# Altium schematic sheet iPhone11-2NEI.SchDoc
size A
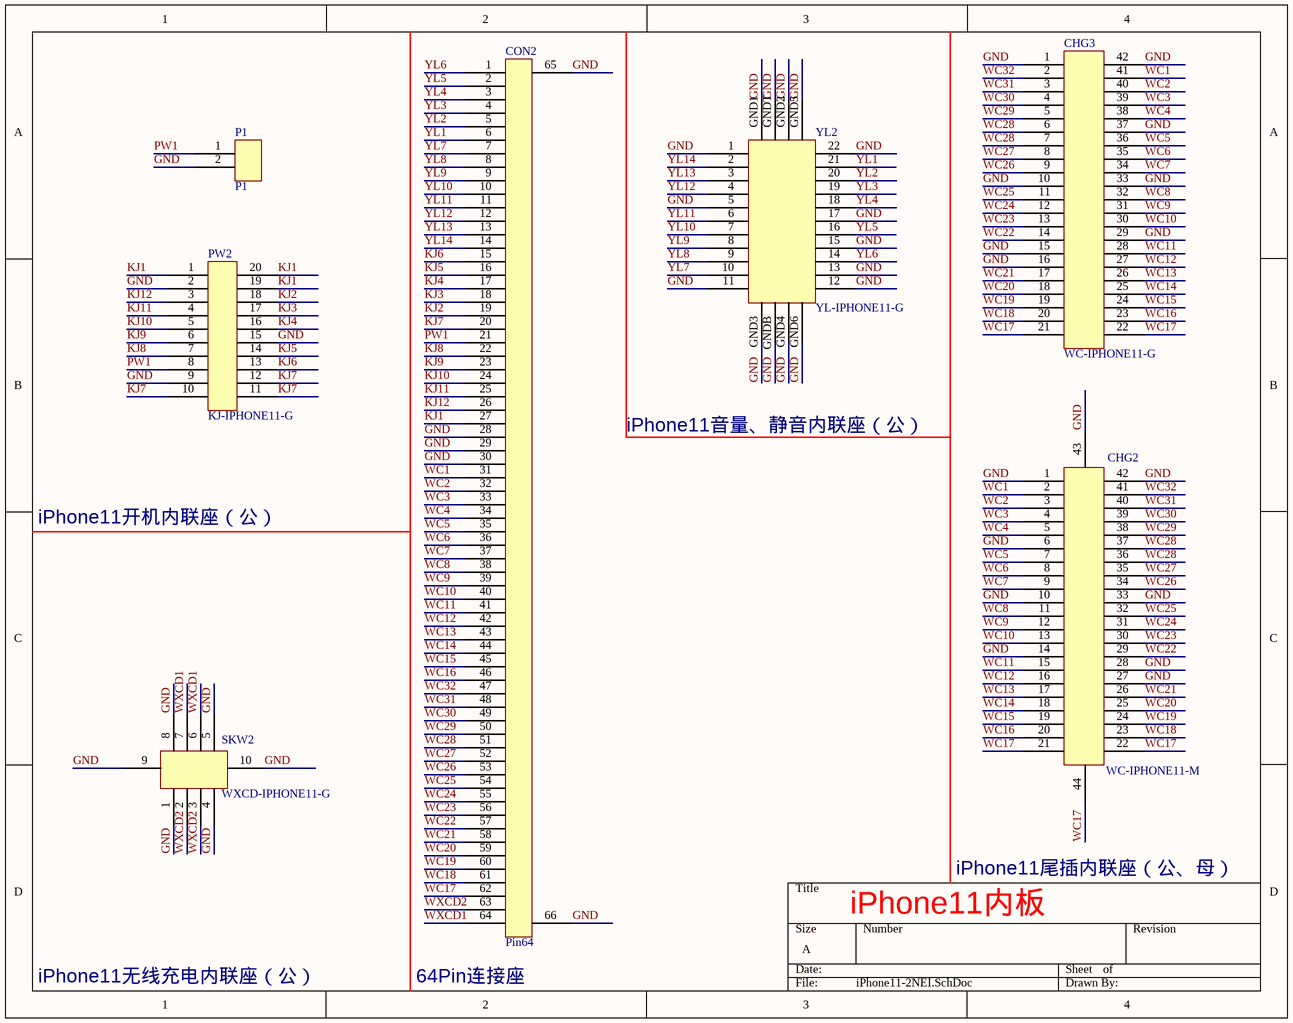
[diagram p0: iPhone11-2NEI.SchDoc]

## Parts
CHG2  WC-IPHONE11-M  [IPHONE11-WC-M]
CHG3  WC-IPHONE11-G  [IPHONE11-WC-G]
CON2  Pin64  [Pin64]
P1  P1  [P-2]
PW2  KJ-IPHONE11-G  [IPHONE11-KJ-G]
SKW2  WXCD-IPHONE11-G  [IPHONE11-WXCD-G]
YL2  YL-IPHONE11-G  [IPHONE11-YL-G]

## Nets
GND: CHG2.1 CHG2.6 CHG2.10 CHG2.14 CHG2.27 CHG2.28 CHG2.33 CHG2.42 CHG2.43 CHG3.1 CHG3.10 CHG3.15 CHG3.16 CHG3.29 CHG3.33 CHG3.37 CHG3.42 CON2.28 CON2.29 CON2.30 CON2.65 CON2.66 P1.2 PW2.2 PW2.9 PW2.15 SKW2.1 SKW2.4 SKW2.5 SKW2.8 SKW2.9 SKW2.10 YL2.1 YL2.5 YL2.11 YL2.12 YL2.13 YL2.15 YL2.17 YL2.22 YL2.GND1 YL2.GND2 YL2.GND3 YL2.GND4 YL2.GND5 YL2.GND6 YL2.GNDB YL2.GNDT
KJ1: CON2.27 PW2.1 PW2.19 PW2.20
KJ2: CON2.19 PW2.18
KJ3: CON2.18 PW2.17
KJ4: CON2.17 PW2.16
KJ5: CON2.16 PW2.14
KJ6: CON2.15 PW2.13
KJ7: CON2.20 PW2.10 PW2.11 PW2.12
KJ8: CON2.22 PW2.7
KJ9: CON2.23 PW2.6
KJ10: CON2.24 PW2.5
KJ11: CON2.25 PW2.4
KJ12: CON2.26 PW2.3
PW1: CON2.21 P1.1 PW2.8
WC1: CHG2.2 CHG3.41 CON2.31
WC2: CHG2.3 CHG3.40 CON2.32
WC3: CHG2.4 CHG3.39 CON2.33
WC4: CHG2.5 CHG3.38 CON2.34
WC5: CHG2.7 CHG3.36 CON2.35
WC6: CHG2.8 CHG3.35 CON2.36
WC7: CHG2.9 CHG3.34 CON2.37
WC8: CHG2.11 CHG3.32 CON2.38
WC9: CHG2.12 CHG3.31 CON2.39
WC10: CHG2.13 CHG3.30 CON2.40
WC11: CHG2.15 CHG3.28 CON2.41
WC12: CHG2.16 CHG3.27 CON2.42
WC13: CHG2.17 CHG3.26 CON2.43
WC14: CHG2.18 CHG3.25 CON2.44
WC15: CHG2.19 CHG3.24 CON2.45
WC16: CHG2.20 CHG3.23 CON2.46
WC17: CHG2.21 CHG2.22 CHG2.44 CHG3.21 CHG3.22 CON2.62
WC18: CHG2.23 CHG3.20 CON2.61
WC19: CHG2.24 CHG3.19 CON2.60
WC20: CHG2.25 CHG3.18 CON2.59
WC21: CHG2.26 CHG3.17 CON2.58
WC22: CHG2.29 CHG3.14 CON2.57
WC23: CHG2.30 CHG3.13 CON2.56
WC24: CHG2.31 CHG3.12 CON2.55
WC25: CHG2.32 CHG3.11 CON2.54
WC26: CHG2.34 CHG3.9 CON2.53
WC27: CHG2.35 CHG3.8 CON2.52
WC28: CHG2.36 CHG2.37 CHG3.6 CHG3.7 CON2.51
WC29: CHG2.38 CHG3.5 CON2.50
WC30: CHG2.39 CHG3.4 CON2.49
WC31: CHG2.40 CHG3.3 CON2.48
WC32: CHG2.41 CHG3.2 CON2.47
WXCD1: CON2.64 SKW2.6 SKW2.7
WXCD2: CON2.63 SKW2.2 SKW2.3
YL1: CON2.6 YL2.21
YL2: CON2.5 YL2.20
YL3: CON2.4 YL2.19
YL4: CON2.3 YL2.18
YL5: CON2.2 YL2.16
YL6: CON2.1 YL2.14
YL7: CON2.7 YL2.10
YL8: CON2.8 YL2.9
YL9: CON2.9 YL2.8
YL10: CON2.10 YL2.7
YL11: CON2.11 YL2.6
YL12: CON2.12 YL2.4
YL13: CON2.13 YL2.3
YL14: CON2.14 YL2.2

## Notes on the sheet
- iPhone11音量、静音内联座（公）
- iPhone11开机内联座（公）
- iPhone11尾插内联座（公、母）
- iPhone11内板
- iPhone11无线充电内联座（公）
- (near CON2) 64Pin连接座